# Altium project BSafeHelmetPCB.PrjPcb
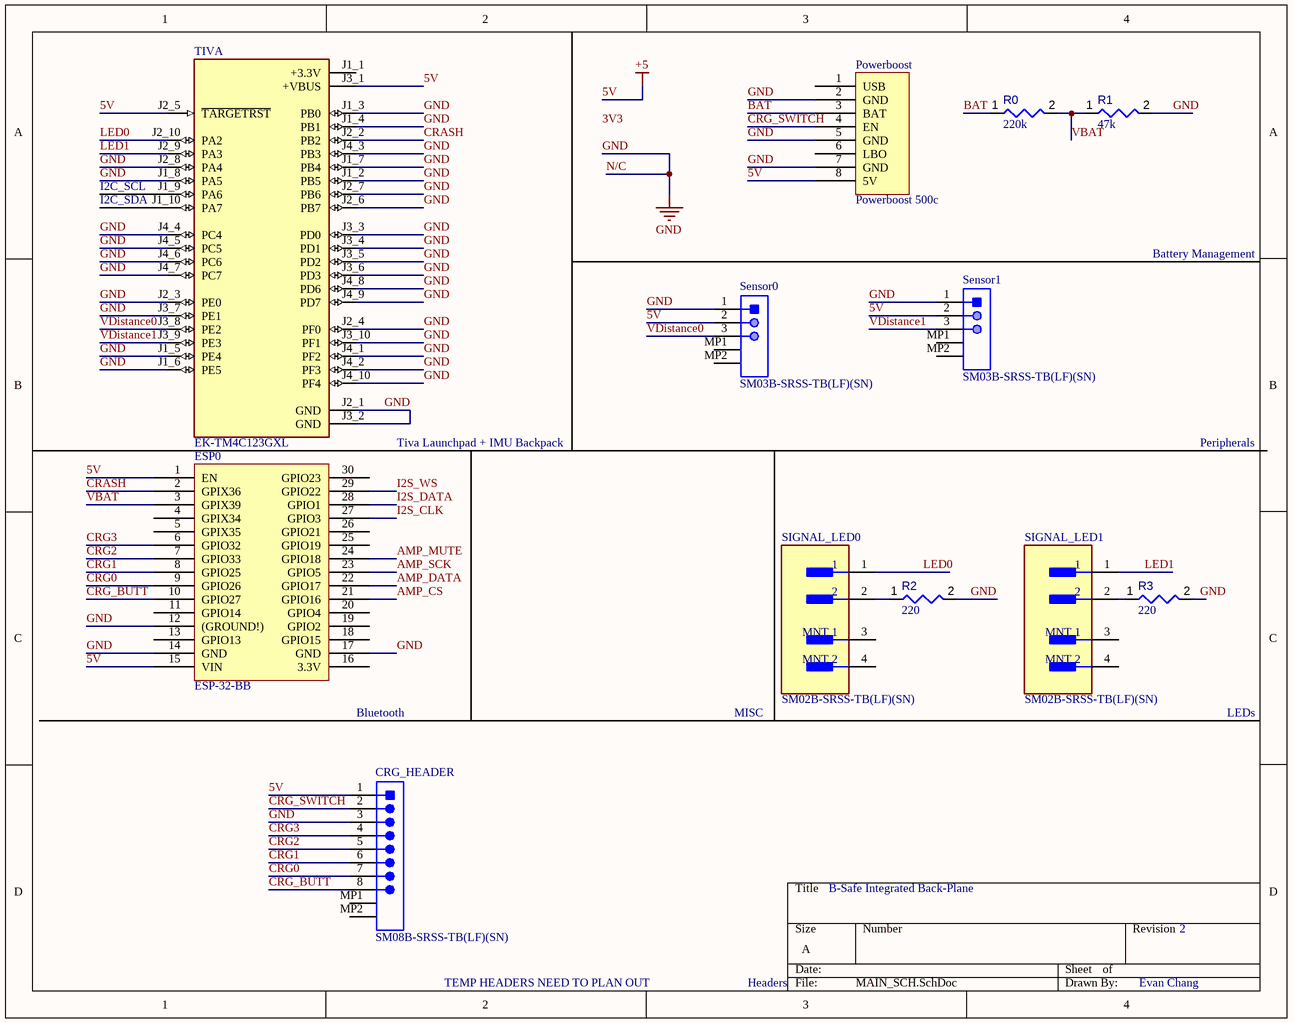
[diagram p0: MAIN_SCH.SchDoc]
3 sheets, 47 parts. Net scope: global (net labels, ports and power ports of the same name join across sheets).
Board file: BSafePCB.PcbDoc
Sheets:
  MAIN_SCH.SchDoc
  PCM.SchDoc
  PGA.SchDoc

## Sheet MAIN_SCH.SchDoc
size A; SheetNumber: 1; SheetTotal: 3

### Parts
CRG_HEADER  SM08B-SRSS-TB(LF)(SN)  [JST-SM08B-SRSS-TB_V]
ESP0  ESP-32-BB  [ESP-32-BB-Footprint-1]
Powerboost  Powerboost 500c  [Powerboost 500c-Footprint-1]
R0  value 220k  [RESC1005X40X25NL05T10]  (hidden comment: RC0402FR-07220KL)
R1  value 47k  [RESC1005X40X25NL05T10]  (hidden comment: RC0402FR-0747KL)
R2  value 220  [RESC1608X55X30LL20T10]  (hidden comment: RK73B1JTTD221J)
R3  value 220  [RESC1608X55X30LL20T10]  (hidden comment: RK73B1JTTD221J)
Sensor0  SM03B-SRSS-TB(LF)(SN)  [JST-SM03B-SRSS-TB_V]
Sensor1  SM03B-SRSS-TB(LF)(SN)  [JST-SM03B-SRSS-TB_V]
SIGNAL_LED0  SM02B-SRSS-TB(LF)(SN)  [FP-SM02B-SRSS-TB_LF_SN-0]
SIGNAL_LED1  SM02B-SRSS-TB(LF)(SN)  [FP-SM02B-SRSS-TB_LF_SN-0]
TIVA  EK-TM4C123GXL  [EK-TM4C123GXL-Footprint-1]

### Nets
5V: CRG_HEADER.1 ESP0.1(EN) ESP0.15(VIN) Powerboost.8(5V) Sensor0.2 Sensor1.2 TIVA.J2_5(~{TARGETRST}) TIVA.J3_1(+VBUS)  [also labelled +5]
GND: CRG_HEADER.3 ESP0.12((GROUND!)) ESP0.14(GND) ESP0.17(GND) Powerboost.2(GND) Powerboost.5(GND) Powerboost.7(GND) R1.2 R2.2 R3.2 Sensor0.1 Sensor1.1 TIVA.J1_2(PB5) TIVA.J1_3(PB0) TIVA.J1_4(PB1) TIVA.J1_5(PE4) TIVA.J1_6(PE5) TIVA.J1_7(PB4) TIVA.J1_8(PA5) TIVA.J2_1(GND) TIVA.J2_3(PE0) TIVA.J2_4(PF0) TIVA.J2_6(PB7) TIVA.J2_7(PB6) TIVA.J2_8(PA4) TIVA.J3_2(GND) TIVA.J3_3(PD0) TIVA.J3_4(PD1) TIVA.J3_5(PD2) TIVA.J3_6(PD3) TIVA.J3_7(PE1) TIVA.J3_10(PF1) TIVA.J4_1(PF2) TIVA.J4_2(PF3) TIVA.J4_3(PB3) TIVA.J4_4(PC4) TIVA.J4_5(PC5) TIVA.J4_6(PC6) TIVA.J4_7(PC7) TIVA.J4_8(PD6) TIVA.J4_9(PD7) TIVA.J4_10(PF4)  [also labelled N/C]
AMP_CS: ESP0.21(GPIO16)
AMP_DATA: ESP0.22(GPIO17)
AMP_MUTE: ESP0.24(GPIO18)
AMP_SCK: ESP0.23(GPIO5)
BAT: Powerboost.3(BAT) R0.1
CRASH: ESP0.2(GPIX36) TIVA.J2_2(PB2)
CRG0: CRG_HEADER.7 ESP0.9(GPIO26)
CRG1: CRG_HEADER.6 ESP0.8(GPIO25)
CRG2: CRG_HEADER.5 ESP0.7(GPIO33)
CRG3: CRG_HEADER.4 ESP0.6(GPIO32)
CRG_BUTT: CRG_HEADER.8 ESP0.10(GPIO27)
CRG_SWITCH: CRG_HEADER.2 Powerboost.4(EN)
I2S_CLK: ESP0.27(GPIO3)
I2S_DATA: ESP0.28(GPIO1)
I2S_WS: ESP0.29(GPIO22)
LED0: SIGNAL_LED0.1 TIVA.J2_10(PA2)
LED1: SIGNAL_LED1.1 TIVA.J2_9(PA3)
VBAT: ESP0.3(GPIX39) R0.2 R1.1
VDistance0: Sensor0.3 TIVA.J3_8(PE2)
VDistance1: Sensor1.3 TIVA.J3_9(PE3)
NetR2_1: R2.1 SIGNAL_LED0.2
NetR3_1: R3.1 SIGNAL_LED1.2

Not connected (* = marked no-connect by the designer): CRG_HEADER MP1 MP2; ESP0 4(GPIX34) 5(GPIX35) 11(GPIO14) 13(GPIO13) 16(3.3V) 18(GPIO15) 19(GPIO2) 20(GPIO4) 25(GPIO19) 26(GPIO21) 30(GPIO23); Powerboost 1(USB) 6(LBO); Sensor0 MP1 MP2; Sensor1 MP1 MP2; SIGNAL_LED0 3(MNT_1) 4(MNT_2); SIGNAL_LED1 3(MNT_1) 4(MNT_2); TIVA J1_1(+3.3V) J1_9(PA6) J1_10(PA7)

### Notes on the sheet
- (near TIVA) I2C_SCL
- (near TIVA) I2C_SDA
- Battery Management
- Tiva Launchpad + IMU Backpack
- Peripherals
- Bluetooth
- MISC
- LEDs
- B-Safe Integrated Back-Plane
- 2
- TEMP HEADERS NEED TO PLAN OUT
- Headers
- Evan Chang
- Labels drawn without touching a wire or pin: 3V3

### Library data of the parts
CRG_HEADER = CMP-002-00073-1: Connector Header, Side Entry, SR Series, 8 Position, 1.00mm, 50V, Surface Mount, Tin, Natural
ESP0 = CMP-00001-11: Breakoutboard for ESP-32-BB
Powerboost = CMP-00002-5: Breakout board component for Adafruit Powerboost 500c
R0 = CMP-009-00179-2: Fixed Resistor, Metal Glaze/thick Film, 0.0625W, 220000ohm, 50V, 1% +/-Tol, 100ppm/Cel, Surface Mount, 0402; Min Operating Temperature: -55°C; Max Operating Temperature: 155°C; RoHS Compliant: Yes; Tolerance: 1%
R1 = CMP-009-00178-2: Fixed Resistor, Metal Glaze/thick Film, 0.0625W, 47000ohm, 50V, 1% +/-Tol, 100ppm/Cel, Surface Mount, 0402; RoHS Compliant: Yes; Min Operating Temperature: -55°C; Max Operating Temperature: 155°C; Tolerance: 1%
R2 R3 = CMP-009-00180-2: Fixed Resistor, Metal Glaze/thick Film, 0.125W, 220ohm, 75V, 5% +/-Tol, 200ppm/Cel, Surface Mount, 0603; Max Operating Temperature: 155°C; RoHS Compliant: Yes; Tolerance: 5%; Min Operating Temperature: -55°C
Sensor0 Sensor1 = CMP-002-00074-1: CONN HEADER SH 3POS SIDE 1MM TIN; Pins: 3
SIGNAL_LED0 SIGNAL_LED1 = CMP-002-00072-1: CONN HEADER SH 2POS SIDE 1MM TIN; Pins: 2
TIVA = CMP-012-000000-3: ARMÂ® CortexÂ®-M4F Based MCU TM4C123G LaunchPadâ„¢ Evaluation Kit; MF: Texas Instruments; Design Item ID: EK-TM4C123GXL; SnapEDA_Link: https://www.snapeda.com/parts/EK-TM4C123GXL/Texas%20Instruments/view-part/132968/?ref=snap; Availability: Warning; Check_prices: https://www.snapeda.com/parts/EK-TM4C123GXL/Texas%20Instruments/view-part/132968/?ref=eda; Price: None; Component Type: Standard; Pin Count: 40; MP: EK-TM4C123GXL; Purchase-URL: https://pricing.snapeda.com/search/part/EK-TM4C123GXL/?ref=eda; Package: None; Source: EK-TM4C123GXL.SchLib; Value: *

## Sheet PCM.SchDoc
size Letter; SheetNumber: 2; SheetTotal: 3
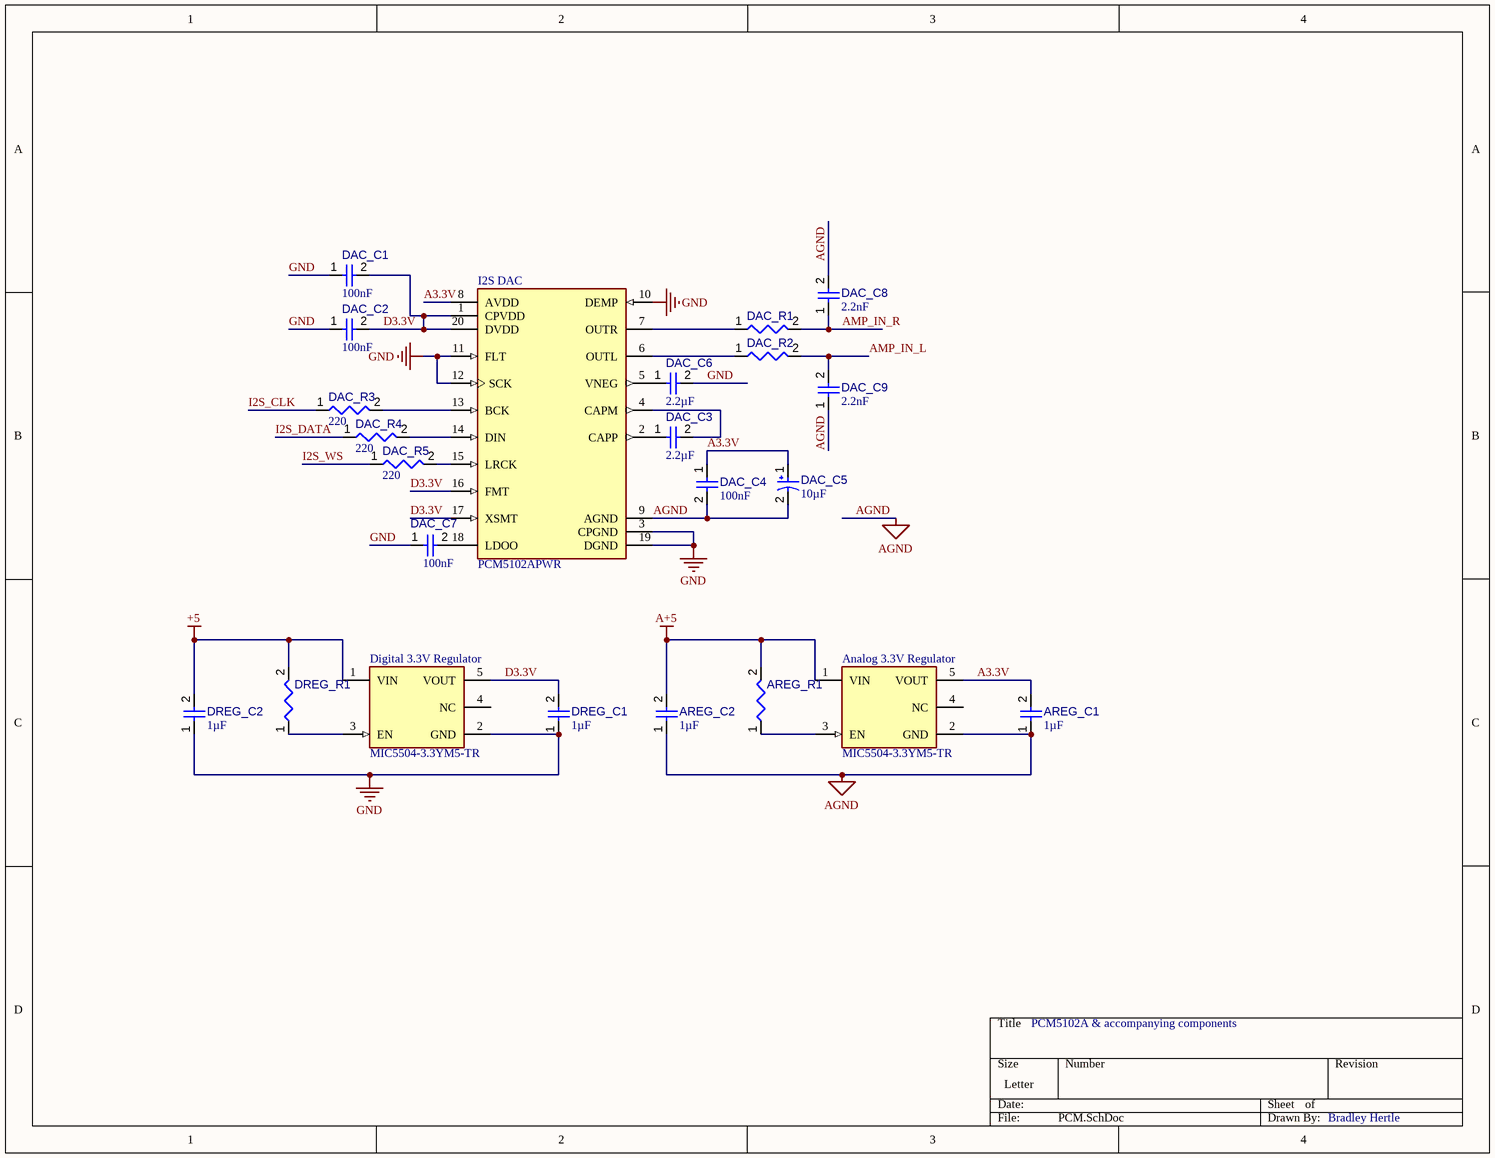
[diagram p1: PCM.SchDoc]

### Parts
Analog_3.3V_Regulator  MIC5504-3.3YM5-TR  [FP-SOT23-5LD-PL-1-IPC_B]
AREG_C1  value 1µF  [CAP_CL05_SAM]  (hidden comment: 1uF 0402 Ceramic)
AREG_C2  value 1µF  [CAP_CL05_SAM]  (hidden comment: 1uF 0402 Ceramic)
AREG_R1  RC0402FR-07220KL  [RESC1005X40X25NL05T10]  (value not drawn)
DAC_C1  value 100nF  [FP-CL278-IPC_A]  (hidden comment: CL05A104KA5NNNC)
DAC_C2  value 100nF  [FP-CL278-IPC_A]  (hidden comment: CL05A104KA5NNNC)
DAC_C3  value 2.2µF  [FP-GRM155-0_05-MFG]  (hidden comment: GRM155R61A225KE01J)
DAC_C4  value 100nF  [FP-CL278-IPC_A]  (hidden comment: CL05A104KA5NNNC)
DAC_C5  value 10µF  [CAPMP3217X18-T_V]  (hidden comment: TAJA106K016RNJ)
DAC_C6  value 2.2µF  [FP-GRM155-0_05-MFG]  (hidden comment: GRM155R61A225KE01J)
DAC_C7  value 100nF  [FP-CL278-IPC_A]  (hidden comment: CL05A104KA5NNNC)
DAC_C8  value 2.2nF  [FP-CL316-IPC_B]  (hidden comment: CL05B222JB5NNNC)
DAC_C9  value 2.2nF  [FP-CL316-IPC_B]  (hidden comment: CL05B222JB5NNNC)
DAC_R1  RC0402FR-07470RL  [RESC1005X40X25NL05T10]  (value not drawn)
DAC_R2  RC0402FR-07470RL  [RESC1005X40X25NL05T10]  (value not drawn)
DAC_R3  value 220  [RESC1608X55X30LL20T10]  (hidden comment: RK73B1JTTD221J)
DAC_R4  value 220  [RESC1608X55X30LL20T10]  (hidden comment: RK73B1JTTD221J)
DAC_R5  value 220  [RESC1608X55X30LL20T10]  (hidden comment: RK73B1JTTD221J)
Digital_3.3V_Regulator  MIC5504-3.3YM5-TR  [FP-SOT23-5LD-PL-1-IPC_B]
DREG_C1  value 1µF  [CAP_CL05_SAM]  (hidden comment: 1uF 0402 Ceramic)
DREG_C2  value 1µF  [CAP_CL05_SAM]  (hidden comment: 1uF 0402 Ceramic)
DREG_R1  RC0402FR-07220KL  [RESC1005X40X25NL05T10]  (value not drawn)
I2S_DAC  PCM5102APWR  [FP-PW0020A-IPC_A]

### Nets
+5: Digital_3.3V_Regulator.1(VIN) DREG_C2.2 DREG_R1.2  [project net 5V]
A+5: Analog_3.3V_Regulator.1(VIN) AREG_C2.2 AREG_R1.2
AGND: Analog_3.3V_Regulator.2(GND) AREG_C1.1 AREG_C2.1 DAC_C4.2 DAC_C5.2 DAC_C8.2 DAC_C9.1 I2S_DAC.9(AGND)
GND: DAC_C1.1 DAC_C2.1 DAC_C6.2 DAC_C7.1 Digital_3.3V_Regulator.2(GND) DREG_C1.1 DREG_C2.1 I2S_DAC.3(CPGND) I2S_DAC.10(DEMP) I2S_DAC.11(FLT) I2S_DAC.12(SCK) I2S_DAC.19(DGND)
A3.3V: Analog_3.3V_Regulator.5(VOUT) AREG_C1.2 DAC_C4.1 DAC_C5.1 I2S_DAC.8(AVDD)
AMP_IN_L: DAC_C9.2 DAC_R2.2
AMP_IN_R: DAC_C8.1 DAC_R1.2
D3.3V: DAC_C1.2 DAC_C2.2 Digital_3.3V_Regulator.5(VOUT) DREG_C1.2 I2S_DAC.1(CPVDD) I2S_DAC.16(FMT) I2S_DAC.17(XSMT) I2S_DAC.20(DVDD)
I2S_CLK: DAC_R3.1
I2S_DATA: DAC_R4.1
I2S_WS: DAC_R5.1
NetAnalog_3.3V_Regulator_3: Analog_3.3V_Regulator.3(EN) AREG_R1.1
NetDAC_C3_1: DAC_C3.1 I2S_DAC.2(CAPP)
NetDAC_C3_2: DAC_C3.2 I2S_DAC.4(CAPM)
NetDAC_C6_1: DAC_C6.1 I2S_DAC.5(VNEG)
NetDAC_C7_2: DAC_C7.2 I2S_DAC.18(LDOO)
NetDAC_R1_1: DAC_R1.1 I2S_DAC.7(OUTR)
NetDAC_R2_1: DAC_R2.1 I2S_DAC.6(OUTL)
NetDAC_R3_2: DAC_R3.2 I2S_DAC.13(BCK)
NetDAC_R4_2: DAC_R4.2 I2S_DAC.14(DIN)
NetDAC_R5_2: DAC_R5.2 I2S_DAC.15(LRCK)
NetDigital_3.3V_Regulator_3: Digital_3.3V_Regulator.3(EN) DREG_R1.1

Not connected (* = marked no-connect by the designer): Analog_3.3V_Regulator 4(NC); Digital_3.3V_Regulator 4(NC)

### Notes on the sheet
- PCM5102A & accompanying components
- Bradley Hertle

### Library data of the parts
Analog_3.3V_Regulator Digital_3.3V_Regulator = CMP-019-00050-1: Fixed Positive LDO Regulator, 3.3V, 0.38V Dropout, CMOS, PDSO5, use this one; RoHS Compliant: Yes
AREG_C1 AREG_C2 DREG_C1 DREG_C2 = CMP-001-00089-6: CL05A105KO5NNNC, Samsung, Ceramic CAP; Source: CL05A105KO5NNNC.SchLib; Mfr_Name: Samsung; Design Item ID: CL05A105KO5NNNC
AREG_R1 DREG_R1 = CMP-009-00179-1: Fixed Resistor, Metal Glaze/thick Film, 0.0625W, 220000ohm, 50V, 1% +/-Tol, 100ppm/Cel, Surface Mount, 0402; Min Operating Temperature: -55°C; RoHS Compliant: Yes; Max Operating Temperature: 155°C; Tolerance: 1%
DAC_C1 DAC_C2 DAC_C4 DAC_C7 = CMP-001-00088-2: Ceramic Capacitor, Multilayer, Ceramic, 25V, 10% +Tol, 10% -Tol, X5R, 15% TC, 0.1uF, Surface Mount, 0402, 0.1uF cap; RoHS Compliant: Yes; Capacitor Type: Ceramic; Min Operating Temperature: -55°C; Max Operating Temperature: 85°C
DAC_C3 DAC_C6 = CMP-001-00090-1: Ceramic Capacitor, Multilayer, Ceramic, 10V, 10% +Tol, 10% -Tol, X5R, 15% TC, 2.2uF, Surface Mount, 0402
DAC_C5 = CMP-001-00041-7: Standard Tantalum, 10 uF, +/- 10%, 16 V, -55 to 125 degC, 1206 (3216 Metric), RoHS, Tape and Reel; Manufacturer: AVX; Voltage Rating: 16V; ESR: 3Ohm; Datasheet URL: http://datasheets.avx.com/TAJ.pdf; Package URL: http://www.avx.com/download/software/literature/AVX-Footprint-Library.pdf; Pins: 2; Package Reference: CAPMP3217X18-T; RoHS Compliant: True; Case/Package: 1206; Max Operating Temperature: 125°C; Package Description: 2-Pin Surface Mount Device, Body 3.2 x 1.65 mm; Mounting Technology: SM; Tolerance: 10%; Package Quantity: 1; Packaging: TapeandReel; Min Operating Temperature: -55°C; Datasheet Version: Feb-16; Manufacturer URL: http://www.avx.com/; Capacitor Type: Tantalum
DAC_C8 DAC_C9 = CMP-001-00087-2: Ceramic Capacitor, Multilayer, Ceramic, 50V, 5% +Tol, 5% -Tol, X7R, 15% TC, 0.0022uF, Surface Mount, 0402, 2.2nF cap; Capacitor Type: Ceramic; Min Operating Temperature: -55°C; RoHS Compliant: Yes; Max Operating Temperature: 125°C
DAC_R1 DAC_R2 = CMP-009-00181-1: Fixed Resistor, Metal Glaze/thick Film, 0.0625W, 470ohm, 50V, 1% +/-Tol, 100ppm/Cel, Surface Mount, 0402; Tolerance: 1%; Max Operating Temperature: 155°C; RoHS Compliant: Yes; Min Operating Temperature: -55°C
DAC_R3-DAC_R5 = CMP-009-00180-2: as R2 on sheet MAIN_SCH; Max Operating Temperature: 155°C; RoHS Compliant: Yes; Tolerance: 5%; Min Operating Temperature: -55°C
I2S_DAC = CMP-00027-00004-1: D/A Converter, 1 Func, Serial Input Loading, PDSO20; RoHS Compliant: Yes; Min Operating Temperature: -25°C; Max Operating Temperature: 85°C

## Sheet PGA.SchDoc
size Letter; SheetNumber: 3; SheetTotal: 3
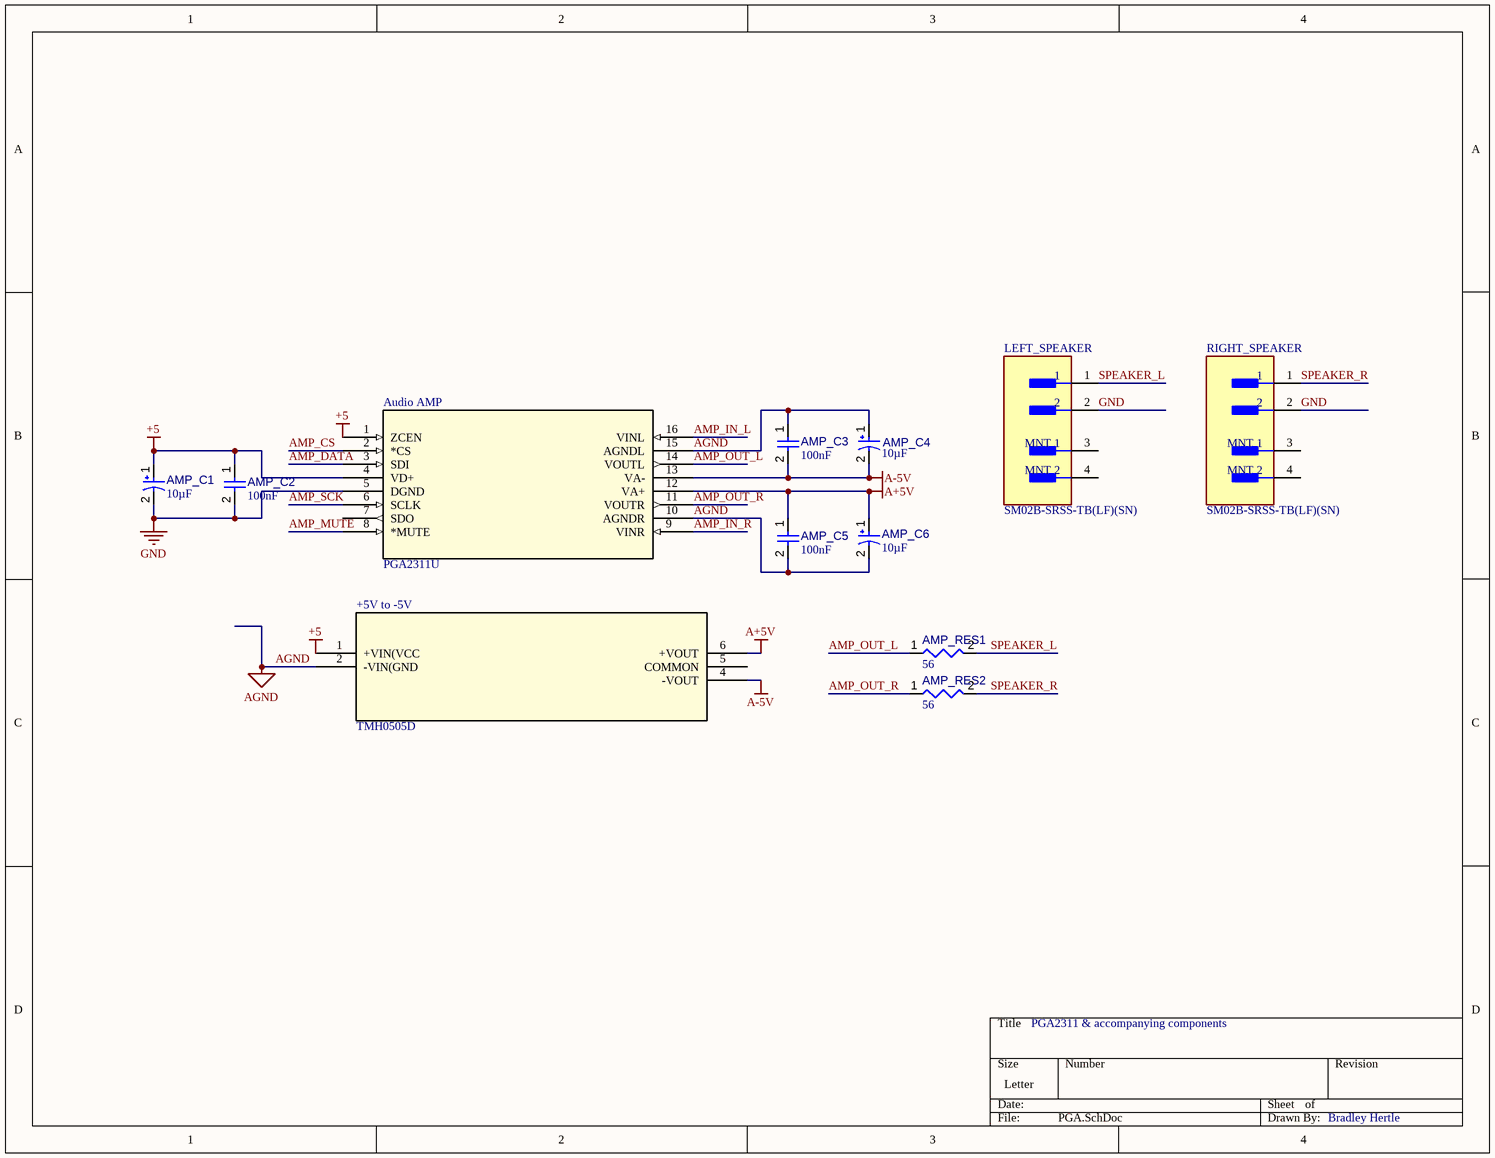
[diagram p2: PGA.SchDoc]

### Parts
+5V_to_-5V  TMH0505D  [TMH DUAL_TRP]
AMP_C1  value 10µF  [CAPMP3217X18-T_V]  (hidden comment: TAJA106K016RNJ)
AMP_C2  value 100nF  [FP-CL278-IPC_A]  (hidden comment: CL05A104KA5NNNC)
AMP_C3  value 100nF  [FP-CL278-IPC_A]  (hidden comment: CL05A104KA5NNNC)
AMP_C4  value 10µF  [CAPMP3217X18-T_V]  (hidden comment: TAJA106K016RNJ)
AMP_C5  value 100nF  [FP-CL278-IPC_A]  (hidden comment: CL05A104KA5NNNC)
AMP_C6  value 10µF  [CAPMP3217X18-T_V]  (hidden comment: TAJA106K016RNJ)
AMP_RES1  value 56  [FP-ESR10-IPC_A]  (hidden comment: ESR10EZPJ560)
AMP_RES2  value 56  [FP-ESR10-IPC_A]  (hidden comment: ESR10EZPJ560)
Audio_AMP  PGA2311U  [DW16]
LEFT_SPEAKER  SM02B-SRSS-TB(LF)(SN)  [FP-SM02B-SRSS-TB_LF_SN-0]
RIGHT_SPEAKER  SM02B-SRSS-TB(LF)(SN)  [FP-SM02B-SRSS-TB_LF_SN-0]

### Nets
+5: +5V_to_-5V.1(+VIN(VCC) AMP_C1.1 AMP_C2.1 Audio_AMP.1(ZCEN) Audio_AMP.4(VD+)  [project net 5V]
A+5V: +5V_to_-5V.6(+VOUT) AMP_C5.1 AMP_C6.1 Audio_AMP.12(VA+)
A-5V: +5V_to_-5V.4(-VOUT) AMP_C3.2 AMP_C4.2 Audio_AMP.13(VA-)
AGND: +5V_to_-5V.2(-VIN(GND) AMP_C3.1 AMP_C4.1 AMP_C5.2 AMP_C6.2 Audio_AMP.10(AGNDR) Audio_AMP.15(AGNDL)
GND: AMP_C1.2 AMP_C2.2 Audio_AMP.5(DGND) LEFT_SPEAKER.2 RIGHT_SPEAKER.2
AMP_CS: Audio_AMP.2(*CS)
AMP_DATA: Audio_AMP.3(SDI)
AMP_IN_L: Audio_AMP.16(VINL)
AMP_IN_R: Audio_AMP.9(VINR)
AMP_MUTE: Audio_AMP.8(*MUTE)
AMP_OUT_L: AMP_RES1.1 Audio_AMP.14(VOUTL)
AMP_OUT_R: AMP_RES2.1 Audio_AMP.11(VOUTR)
AMP_SCK: Audio_AMP.6(SCLK)
SPEAKER_L: AMP_RES1.2 LEFT_SPEAKER.1
SPEAKER_R: AMP_RES2.2 RIGHT_SPEAKER.1

Not connected (* = marked no-connect by the designer): +5V_to_-5V 5(COMMON); Audio_AMP 7(SDO); LEFT_SPEAKER 3(MNT_1) 4(MNT_2); RIGHT_SPEAKER 3(MNT_1) 4(MNT_2)

### Notes on the sheet
- PGA2311 & accompanying components
- Bradley Hertle

### Library data of the parts
+5V_to_-5V = CMP-019-00049-2: DC-DC Regulated Power Supply Module, 2 Output, 2W, Hybrid; RoHS Compliant: Yes; Min Operating Temperature: -40°C; Max Operating Temperature: 85°C
AMP_C1 AMP_C4 AMP_C6 = CMP-001-00041-7: as DAC_C5 on sheet PCM; Datasheet URL: http://datasheets.avx.com/TAJ.pdf; Package URL: http://www.avx.com/download/software/literature/AVX-Footprint-Library.pdf; Pins: 2; Package Reference: CAPMP3217X18-T; RoHS Compliant: True; Case/Package: 1206; Max Operating Temperature: 125°C; Package Description: 2-Pin Surface Mount Device, Body 3.2 x 1.65 mm; Mounting Technology: SM; Tolerance: 10%; Package Quantity: 1; Packaging: TapeandReel; Min Operating Temperature: -55°C; Datasheet Version: Feb-16; Manufacturer URL: http://www.avx.com/; Capacitor Type: Tantalum
AMP_C2 AMP_C3 AMP_C5 = CMP-001-00088-2: as DAC_C1 on sheet PCM; RoHS Compliant: Yes; Capacitor Type: Ceramic; Min Operating Temperature: -55°C; Max Operating Temperature: 85°C
AMP_RES1 AMP_RES2 = CMP-009-00182-1: Fixed Resistor, Metal Glaze/thick Film, 0.4W, 56ohm, 150V, 5% +/-Tol, 200ppm/Cel, Surface Mount, 0805; Min Operating Temperature: -55°C; RoHS Compliant: Yes; Max Operating Temperature: 155°C; Tolerance: 5%
Audio_AMP = CMP-005-000000-2: No Description Available; Mfr_Name: Texas Instruments; Design Item ID: PGA2311U; RefDes: RefDes; Type: Type; Source: PGA2311U.SchLib
LEFT_SPEAKER RIGHT_SPEAKER = CMP-002-00072-1: CONN HEADER SH 2POS SIDE 1MM TIN; Pins: 2

## Nets that join several sheets
5V: MAIN_SCH (8 pins), PCM (Digital_3.3V_Regulator.1 DREG_C2.2 DREG_R1.2), PGA (5 pins)
AGND: PCM (8 pins), PGA (7 pins)
GND: MAIN_SCH (42 pins), PCM (12 pins), PGA (5 pins)
AMP_CS: MAIN_SCH (ESP0.21), PGA (Audio_AMP.2)
AMP_DATA: MAIN_SCH (ESP0.22), PGA (Audio_AMP.3)
AMP_IN_L: PCM (DAC_C9.2 DAC_R2.2), PGA (Audio_AMP.16)
AMP_IN_R: PCM (DAC_C8.1 DAC_R1.2), PGA (Audio_AMP.9)
AMP_MUTE: MAIN_SCH (ESP0.24), PGA (Audio_AMP.8)
AMP_SCK: MAIN_SCH (ESP0.23), PGA (Audio_AMP.6)
I2S_CLK: MAIN_SCH (ESP0.27), PCM (DAC_R3.1)
I2S_DATA: MAIN_SCH (ESP0.28), PCM (DAC_R4.1)
I2S_WS: MAIN_SCH (ESP0.29), PCM (DAC_R5.1)